# EAGLE design audio-connector-breakout (EAGLE 7.7.0)
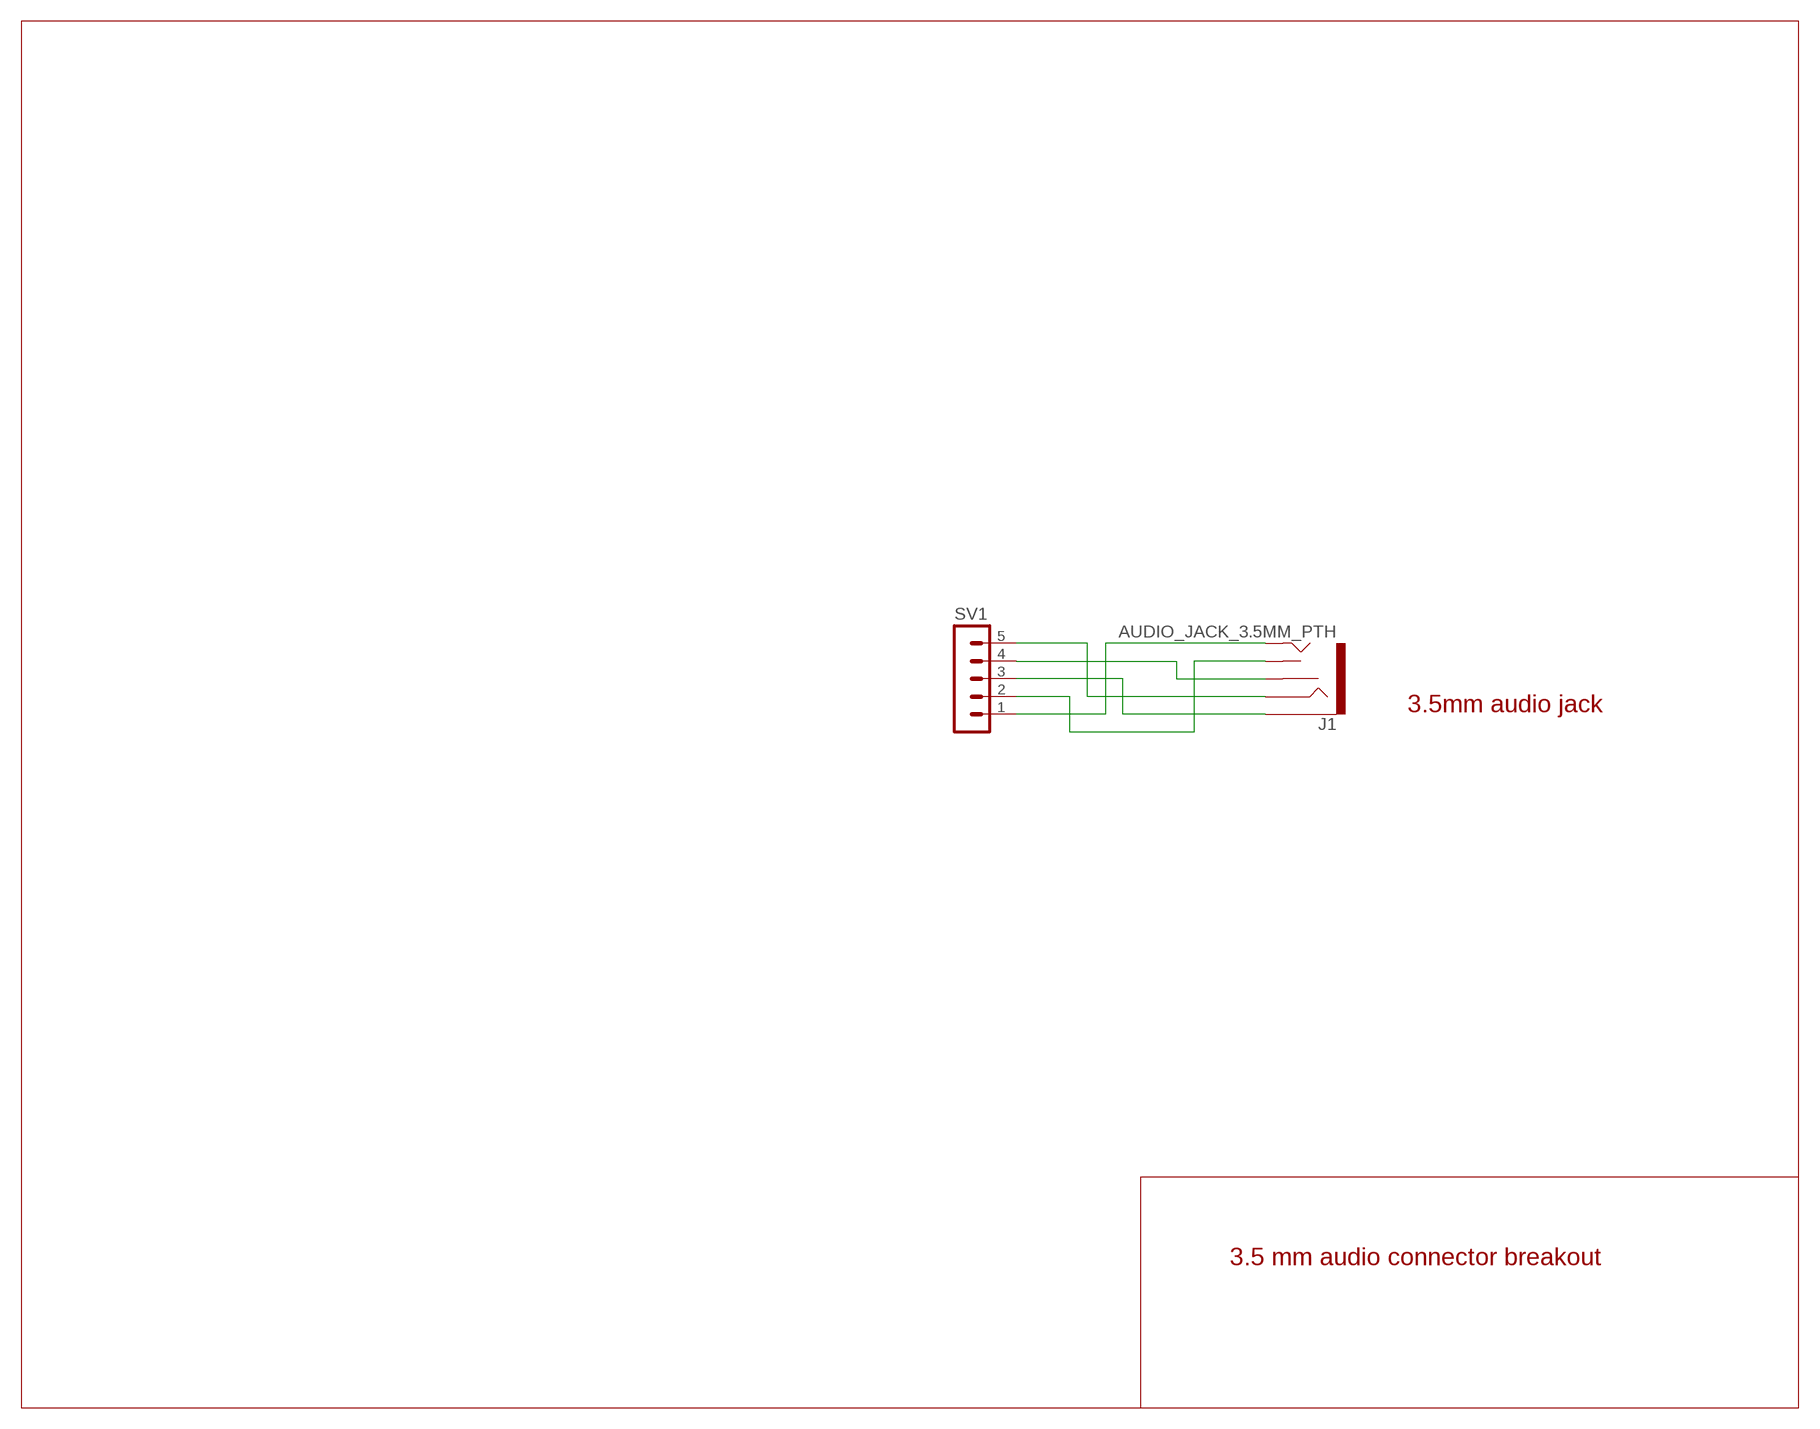
[diagram p0: schematic, sheet 1]

## Parts
J1  AUDIO_JACK_3.5MM_PTH  [AUDIO-JACK]
SV1  MA05-1  [MA05-1]

## Nets
N$1: J1.SLEEVE SV1.3
N$2: J1.TIP SV1.1
N$3: J1.RING SV1.5
N$4: J1.RSH SV1.4
N$5: J1.TSH SV1.2

## Notes on the sheet
- 3.5mm audio jack
- 3.5 mm audio connector breakout

## Library data of the parts
J1 = SparkFun-Connectors:AUDIO_JACK_3.5MM: Audio Jack 3.5mm variants of PTH and SMT stereo audio jack with bypass switches. SparkFun Products: SparkFun SparkPunk Sound Kit <[https://www.sparkfun.com/products/11177]> - PTH MP3 Trigger <https://www.sparkfun.com/products/13720> -3.5mm SMD SparkFun PicoBoard <https://www.sparkfun.com/products/11888>- 2.5mm SMD; PROD_ID: CONN-08774; SF_ID: PRT-08032
SV1 = con-lstb:MA05-1: PIN HEADER; OC_FARNELL: unknown; OC_NEWARK: unknown

## Board
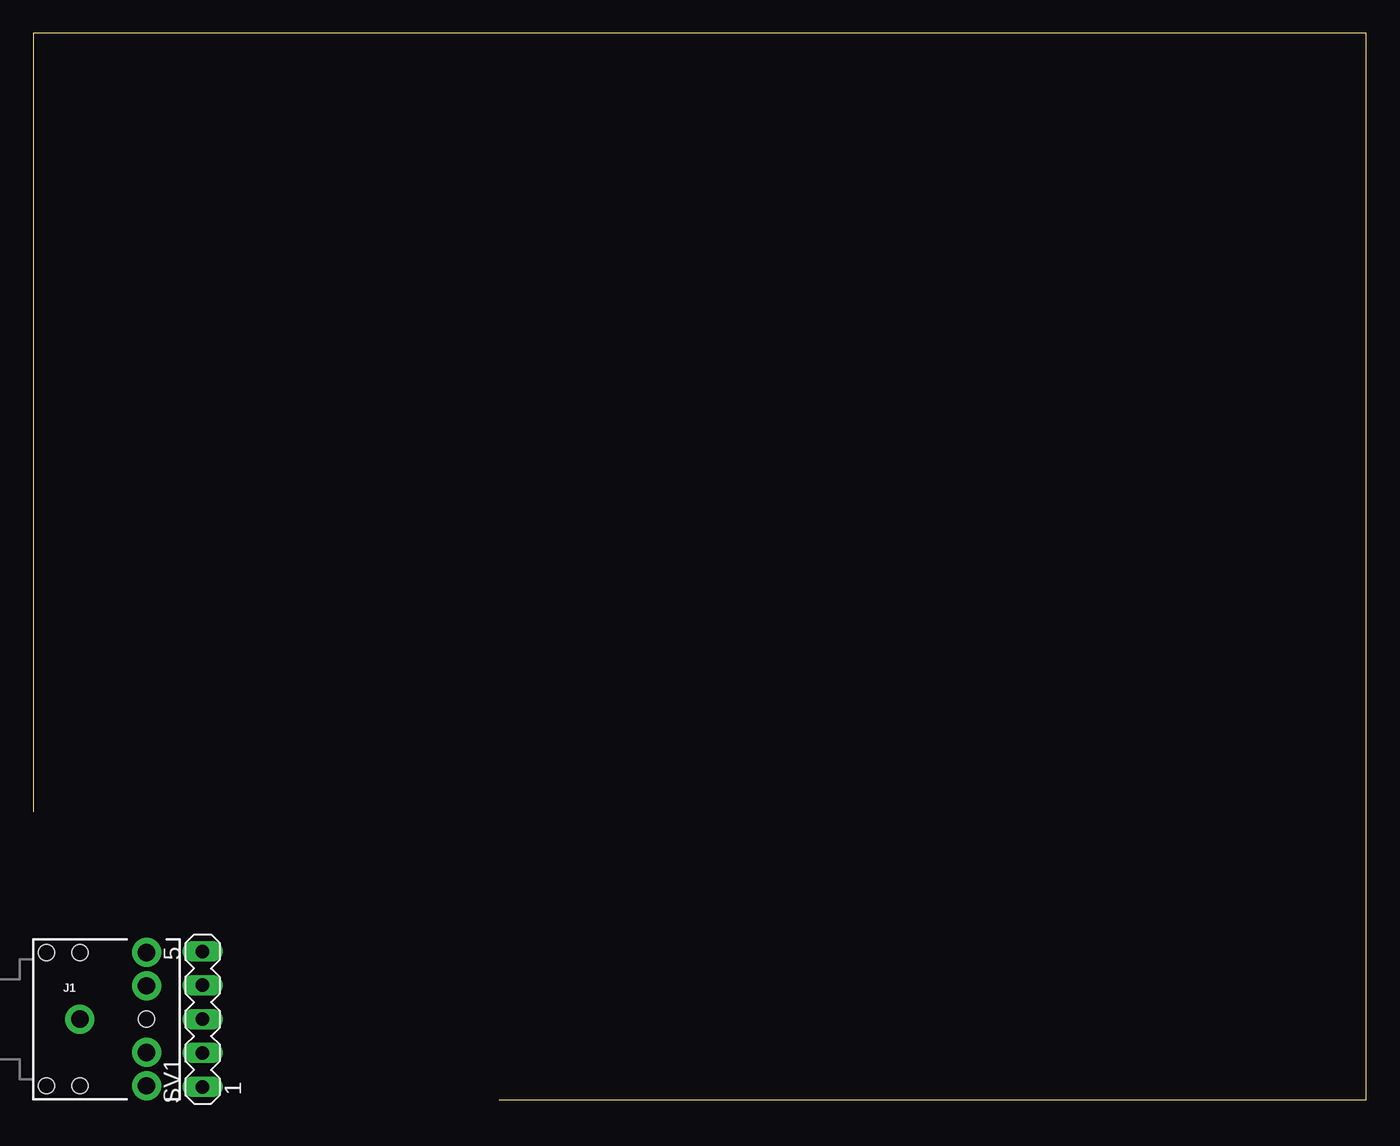
[diagram p1: board, top side]
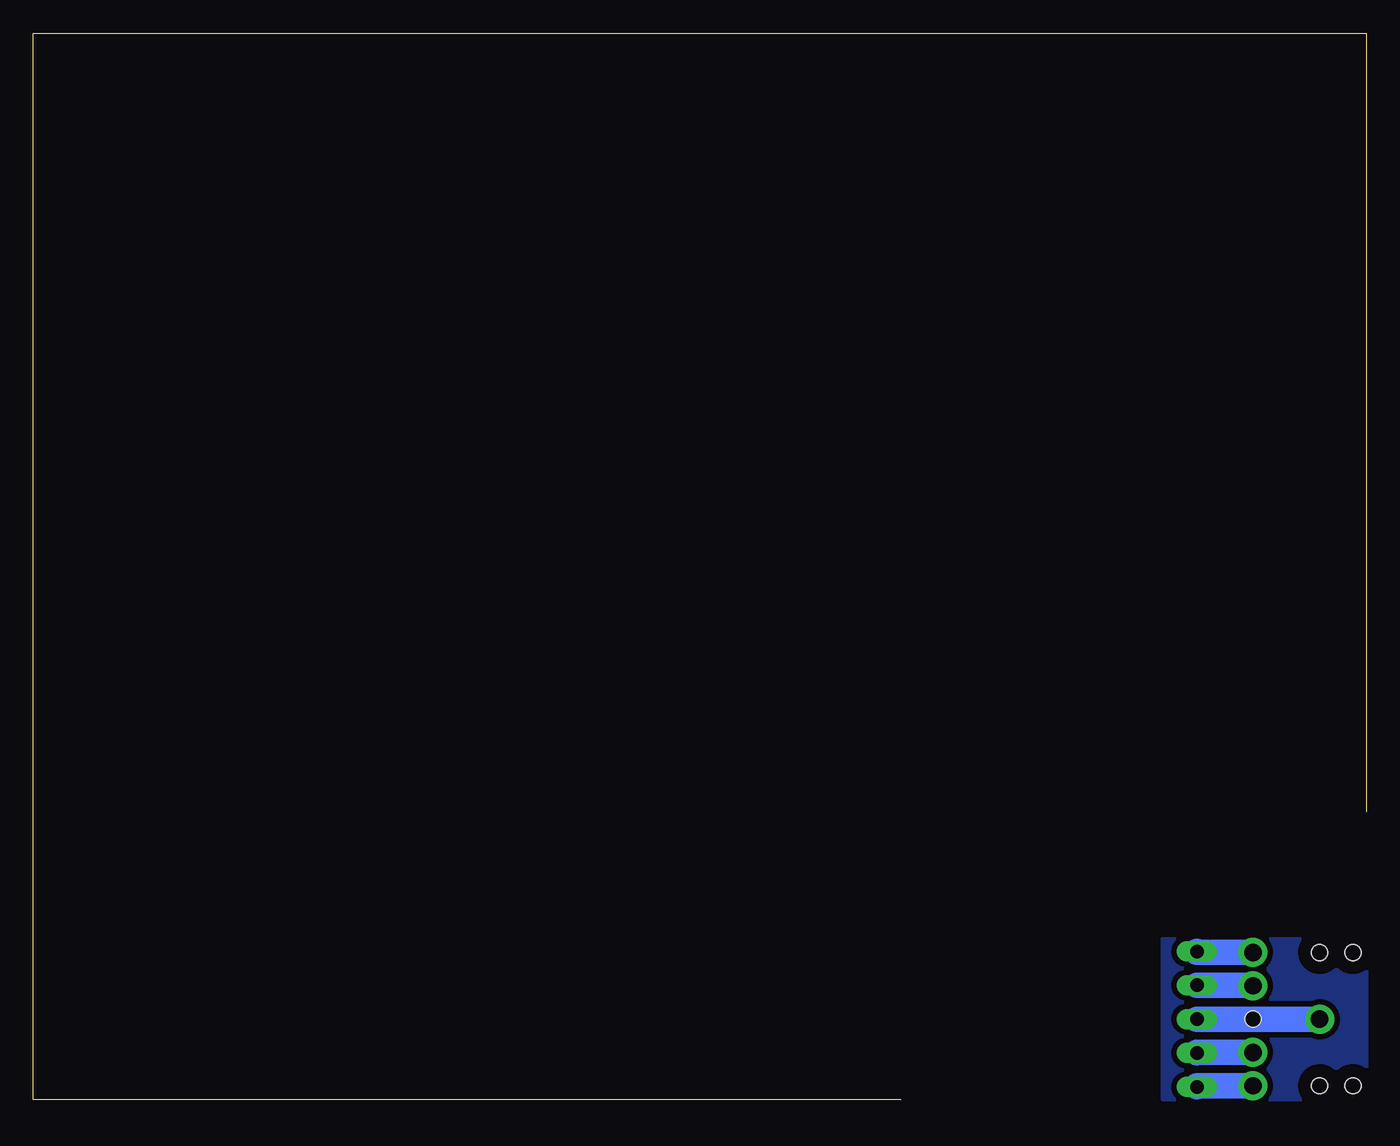
[diagram p2: board, bottom side, seen from below]

Size 100 x 80 mm. Coordinates in mm from the lower left corner, seen from the top.
Outline: 34.92,0 100,0 100,80 0,80 0,21.59
Copper layers (1*16): Top 0.035mm / dielectric 1.5mm / Bottom 0.035mm
Design rules "default": minimum track width 10mil, minimum drill 24mil, track to track 8mil, track to pad 8mil, pad to pad 8mil, via to via 8mil, smd to smd 8mil, copper to edge 40mil, drill to drill 8mil, minimum pad ring 10mil, minimum via ring 8mil, stop-mask expansion 4mil, vias tented up to drill 0mil, thermal gap 10mil

### Footprints (pad centres in the part's own frame; a part is rotated, then mirrored left to right if it is on the bottom)
AUDIO-JACK = drill 1.3 pad 2.184: RING 5,5; RSH 5,2.5; SLEEVE 0,0; TIP 5,-5; TSH 5,-2.5 | hole 1.2: 0,5; -2.5,5; -2.5,-5; 0,-5; 5,0
MA05-1 = drill 1.016 long: 1 -5.08,0; 2 -2.54,0; 3 0,0; 4 2.54,0; 5 5.08,0

### Placement (x,y rotation side)
J1  3.49,6.03 0 top
SV1  12.7,6.03 90 top

### Tracks (layer width: path | path; a pad name or v marks a point on that pad's centre or on a via)
GND
  pour Bottom (isolate 0.406): 0,0 15.24,0 15.24,12.06 0,12.06
N$1
  Bottom 1.93: J1.SLEEVE SV1.3
N$2
  Bottom 1.93: J1.TIP 12.7,1.03 SV1.1
N$3
  Bottom 1.93: J1.RING 12.7,11.03 SV1.5
N$4
  Bottom 1.93: SV1.4 8.49,8.57 J1.RSH
N$5
  Bottom 1.93: J1.TSH 12.7,3.53 SV1.2